# Altium schematic sheet BMI270_IMU.SchDoc: BMA253 Orientation Sensor
size A4; DocumentNumber: 21; SheetNumber: 21; SheetTotal: 51
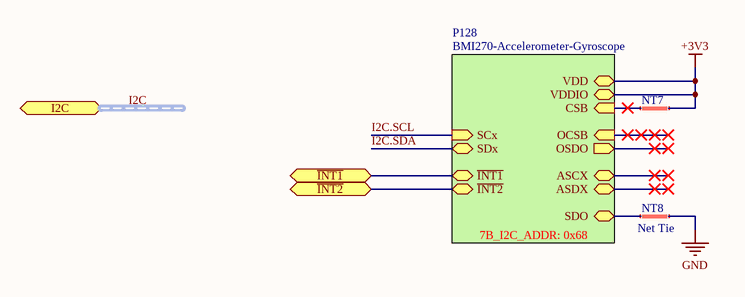
[diagram p0: BMI270_IMU.SchDoc]

## Parts
NT7  Net Tie  [Net Tie 6x30mil]  (value not drawn)  (net tie, no BOM)
NT8  Net Tie  [Net Tie 6x30mil]  (net tie, no BOM)

## Sub-sheets
P128 = BMI270-Accelerometer-Gyroscope: SCx (in), SDx (bidir), VDD, VDDIO, ~{INT1} (bidir), ~{INT2} (bidir), SDO (bidir), ASCX (bidir), ASDX (bidir), OCSB (in), OSDO (out), CSB (in)  | 7B_I2C_ADDR: 0x68

## Ports
I2C (harness I2C), ~{INT1} (bidir), ~{INT2} (bidir)

## Nets
+3V3: NT7.2 ; sheet P128/VDD, sheet P128/VDDIO
GND: NT8.2
~{INT1}: port ~{INT1}, sheet P128/~{INT1}
~{INT2}: port ~{INT2}, sheet P128/~{INT2}
I2C.SCL: sheet P128/SCx
I2C.SDA: sheet P128/SDx
NetNT7_1: NT7.1 ; sheet P128/CSB
NetNT8_1: NT8.1 ; sheet P128/SDO

## Buses and harness runs
harness I2C = port I2C

## Notes on the sheet
- Title
- Size:
- Date:
- A4
- Number:
- Time:
- Revision:
- Sheet
- of
- File:

## Library data of the parts
NT7 NT8 = Net Tie Line: ClassName: P128